# Altium schematic sheet ESP power.SchDoc: ESP Power Management
size 203 x 127 mm; DrawnBy: Kace Chandler; DocumentNumber: 15; SheetNumber: 15; SheetTotal: 23
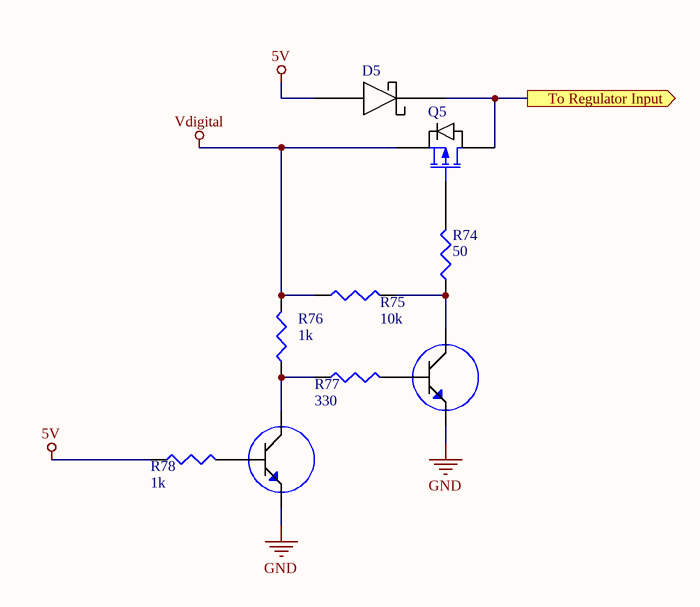
[diagram p0: ESP power.SchDoc]

## Parts
D5  Buck Diode  [*DO-214AC]  (value not drawn)
Q5  P-Channel  [P Channel MOSFET]  (value not drawn)
R74  value 50  [0603 to 0805 SMD]  (hidden comment: Res3)
R75  value 10k  [0603 to 0805 SMD]  (hidden comment: Res3)
R76  value 1k  [0603 to 0805 SMD]  (hidden comment: Res3)
R77  value 330  [0603 to 0805 SMD]  (hidden comment: Res3)
R78  value 1k  [0603 to 0805 SMD]  (hidden comment: Res3)
T10  MMBT2222ALT1  [BJT]  (value not drawn)
T11  MMBT2222ALT1  [BJT]  (value not drawn)

## Ports
To Regulator Input (out)

## Nets
5V: D5.1(A) R78.1
GND: T10.2(E) T11.2(E)
Vdigital: Q5.2(S) R75.1 R76.2
To Regulator Input: D5.2(C) Q5.3(D) ; port To Regulator Input
NetQ5_1: Q5.1(G) R74.2
NetR74_1: R74.1 R75.2 T10.3(C)
NetR76_1: R76.1 R77.1 T11.3(C)
NetR77_2: R77.2 T10.1(B)
NetR78_2: R78.2 T11.1(B)

## Library data of the parts
R74-R78 = Res3: Resistor; Published: 8-Jun-2000; LatestRevisionDate: 29-May-2009; LatestRevisionNote: IPC-7351 Footprint Added.; PackageReference: J1-0603; Publisher: Altium Limited; PackageDescription: Chip Resistor
T10 T11 = BJT NPN: Trans NPN 40V 0.6A SOT23; MF: ON Semiconductor; SnapEDA_Link: https://www.snapeda.com/parts/MMBT2222ALT1/ON%20Semiconductor/view-part/?ref=snap; Price: None; Availability: Unavailable; MP: MMBT2222ALT1; Package: SOT-23 Motorola; Value: *; Supplier 1: Digi-Key; Supplier Part Number 1: MMBT2222ATPMSCT-ND
D5 = Buck Diode: Supplier 1: Digi-Key; Supplier Part Number 1: VSSC8L45-M3/9ATGICT-ND
Q5 = P-Channel: Supplier 1: Digi-Key; Supplier Part Number 1: SI2343CDS-T1-GE3CT-ND